# Altium project OSSI-1 Beacon.PrjPcb
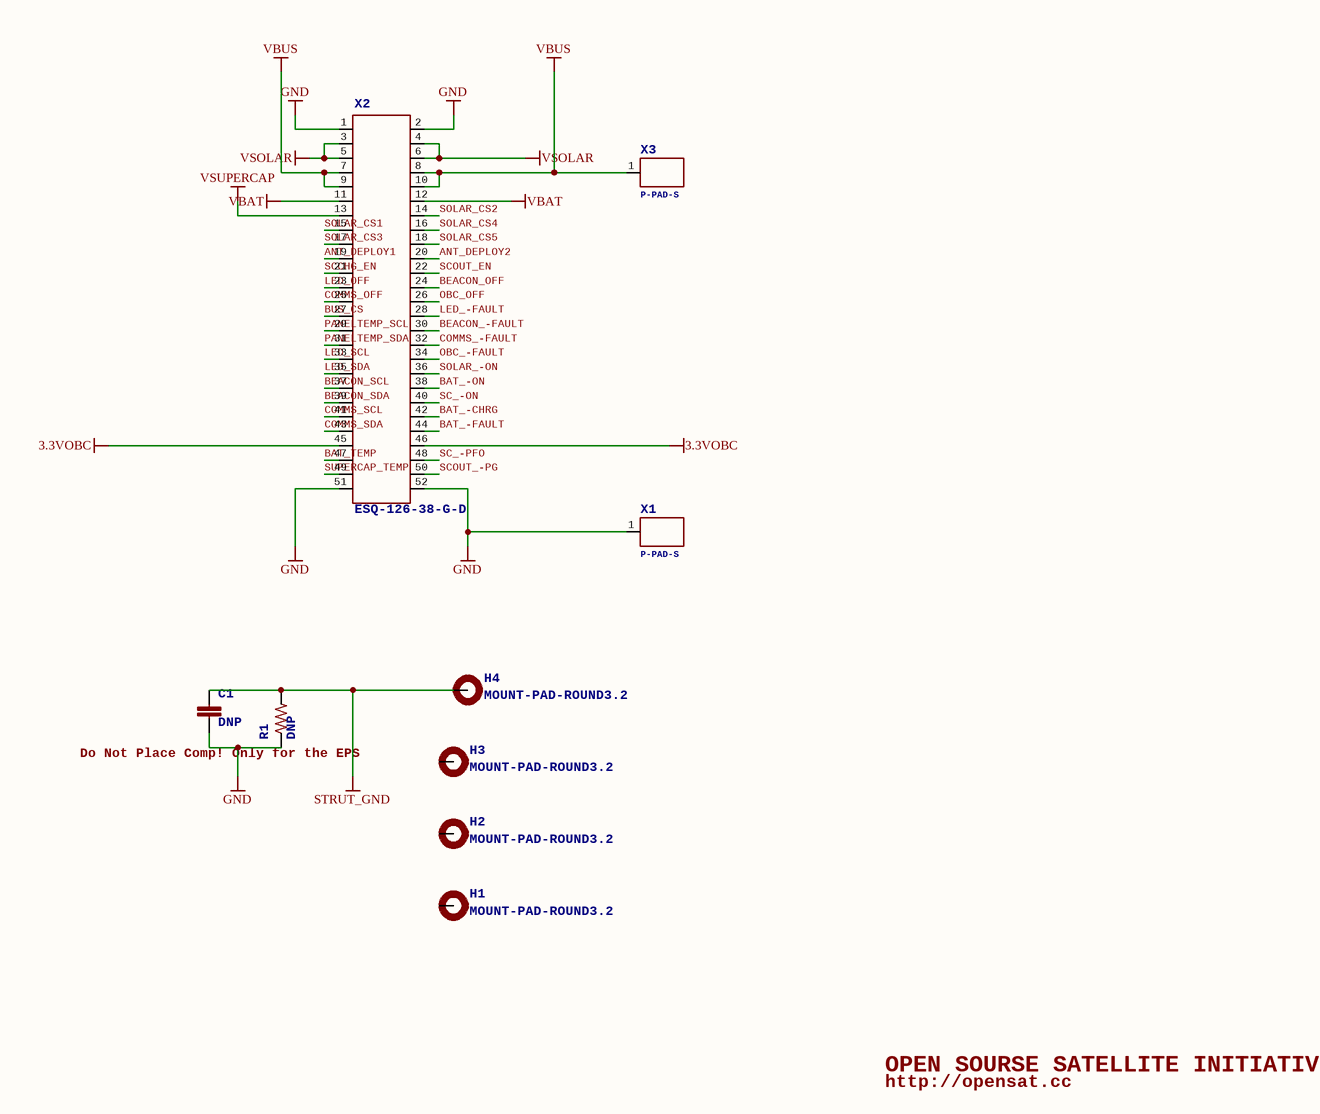
[diagram p0: OSSI-1 Beacon_0.SchDoc]
4 sheets, 116 parts. Net scope: global (net labels, ports and power ports of the same name join across sheets).
Board file: OSSI-1 Beacon.PcbDoc
Sheets:
  OSSI-1 Beacon_0.SchDoc
  OSSI-1 Beacon_1.SchDoc
  OSSI-1 Beacon_2.SchDoc
  OSSI-1 Beacon_3.SchDoc

## Sheet OSSI-1 Beacon_0.SchDoc: TITLE:
size 410 x 286 mm; Date: Date:; >LAST_DATE_TIME: 01/11/2015 13:17:32; Sheet:: Sheet:; >SHEET: 1; REV:: REV:; Document Number:: Document Number:; >DRAWING_NAME: OSSI-1 Beacon.sch

### Parts
C1  >NAME: C1  [C0805(2012)]  (hidden comment: DNP)
H1  >NAME: H1  [3.2-PAD-ROUND]  (hidden comment: MOUNT-PAD-ROUND3.2)
H2  >NAME: H2  [3.2-PAD-ROUND]  (hidden comment: MOUNT-PAD-ROUND3.2)
H3  >NAME: H3  [3.2-PAD-ROUND]  (hidden comment: MOUNT-PAD-ROUND3.2)
H4  >NAME: H4  [3.2-PAD-ROUND]  (hidden comment: MOUNT-PAD-ROUND3.2)
R1  >NAME: R1  [WSL1206]  (hidden comment: DNP)
X1  >NAME: X1  [P-PAD-S]  (hidden comment: P-PAD-S)
X2  >NAME: X2  [ESQ-126-XX-X-D]  (hidden comment: ESQ-126-38-G-D)
X3  >NAME: X3  [P-PAD-S]  (hidden comment: P-PAD-S)

### Nets
3.3VOBC: X2.45 X2.46
GND: C1.2 R1.P$1 X1.1(P$1) X2.1 X2.2 X2.51 X2.52
STRUT_GND: C1.1 H4.B3,2(MOUNT) R1.P$2
VBAT: X2.11 X2.12
VBUS: X2.7 X2.8 X2.9 X2.10 X3.1(P$1)
VSOLAR: X2.3 X2.4 X2.5 X2.6
VSUPERCAP: X2.13
ANT_DEPLOY1: X2.19
ANT_DEPLOY2: X2.20
BAT_-CHRG: X2.42
BAT_-FAULT: X2.44
BAT_-ON: X2.38
BAT_TEMP: X2.47
BEACON_-FAULT: X2.30
BEACON_OFF: X2.24
BEACON_SCL: X2.37
BEACON_SDA: X2.39
BUS_CS: X2.27
COMMS_-FAULT: X2.32
COMMS_OFF: X2.25
COMMS_SCL: X2.41
COMMS_SDA: X2.43
LED_-FAULT: X2.28
LED_OFF: X2.23
LED_SCL: X2.33
LED_SDA: X2.35
OBC_-FAULT: X2.34
OBC_OFF: X2.26
PANELTEMP_SCL: X2.29
PANELTEMP_SDA: X2.31
SC_-ON: X2.40
SC_-PFO: X2.48
SCCHG_EN: X2.21
SCOUT_-PG: X2.50
SCOUT_EN: X2.22
SOLAR_-ON: X2.36
SOLAR_CS1: X2.15
SOLAR_CS2: X2.14
SOLAR_CS3: X2.17
SOLAR_CS4: X2.16
SOLAR_CS5: X2.18
SUPERCAP_TEMP: X2.49

Not connected (* = marked no-connect by the designer): H1 B3,2(MOUNT); H2 B3,2(MOUNT); H3 B3,2(MOUNT)

### Notes on the sheet
- (near R1) Do Not Place Comp! Only for the EPS
- OPEN SOURSE SATELLITE INITIATIVE
- http://opensat.cc

### Library data of the parts
C1 = C0805(2012): >VALUE: DNP
R1 = RWSL1206: >VALUE: DNP
X2 = ESQ-126-38-G-D: <b>Samtec ESQ-126-XX-G-D Elevated Sockets Seires</b> / <ul> / <li> ESQ-126-37-G-D</li> / <li> ESQ-126-38-G-D</li> / <li> ESQ-126-39-G-D</li> / </ul>; >VALUE: ESQ-126-38-G-D
H1-H4 = MOUNT-PAD-ROUND3.2: >VALUE: MOUNT-PAD-ROUND3.2
X1 X3 = P-PAD-S: >VALUE: P-PAD-S

## Sheet OSSI-1 Beacon_1.SchDoc: TITLE:
size 410 x 286 mm; Date: Date:; >LAST_DATE_TIME: 01/11/2015 13:17:35; Sheet:: Sheet:; >SHEET: 2; REV:: REV:; Document Number:: Document Number:; >DRAWING_NAME: OSSI-1 Beacon.sch
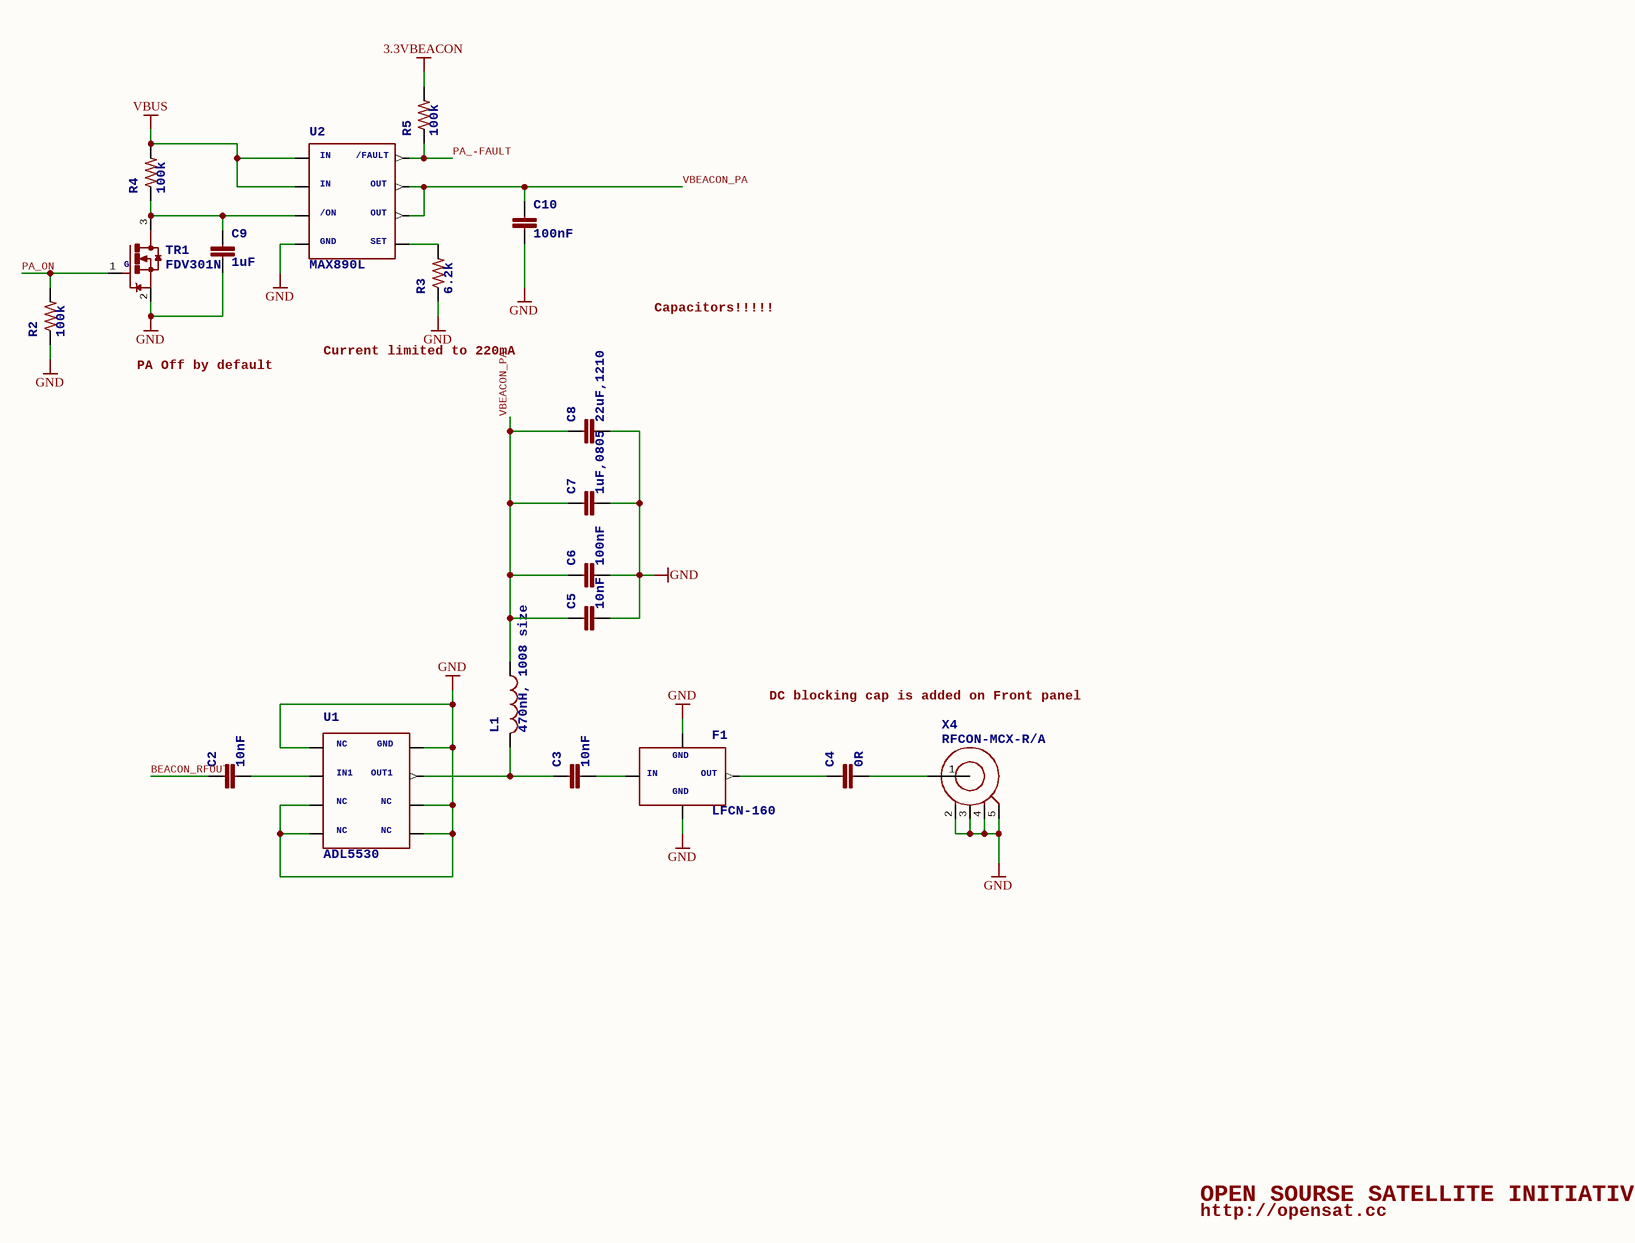
[diagram p1: OSSI-1 Beacon_1.SchDoc]

### Parts
C2  >NAME: C2  [C0603(1608)]  (hidden comment: 10nF)
C3  >NAME: C3  [C0603(1608)]  (hidden comment: 10nF)
C4  >NAME: C4  [C0603(1608)]  (hidden comment: 0R)
C5  >NAME: C5  [C0603(1608)]  (hidden comment: 10nF)
C6  >NAME: C6  [C0603(1608)]  (hidden comment: 100nF)
C7  >NAME: C7  [C0805(2012)]  (hidden comment: 1uF,0805)
C8  >NAME: C8  [C1210-GCM32]  (hidden comment: 22uF,1210)
C9  >NAME: C9  [C0603(1608)]  (hidden comment: 1uF)
C10  >NAME: C10  [C0603(1608)]  (hidden comment: 100nF)
F1  >NAME: F1  [LFCN]  (hidden comment: LFCN-160)
L1  >NAME: L1  [L1008(2520)]  (hidden comment: 470nH, 1008 size)
R2  >NAME: R2  [R0603(1608)]  (hidden comment: 100k)
R3  >NAME: R3  [R0603(1608)]  (hidden comment: 6.2k)
R4  >NAME: R4  [R0603(1608)]  (hidden comment: 100k)
R5  >NAME: R5  [R0603(1608)]  (hidden comment: 100k)
TR1  >NAME: TR1  [SOT23]  (hidden comment: FDV301N)
U1  >NAME: U1  [LFCSP8_CP]  (hidden comment: ADL5530)
U2  >NAME: U2  [SO8]  (hidden comment: MAX890L)
X4  >NAME: X4  [MCX-R/A]  (hidden comment: RFCON-MCX-R/A)

### Nets
3.3VBEACON: R5.2
GND: C5.2 C6.2 C7.2 C8.P$2 C9.2 C10.2 F1.2(P$2) F1.4(P$4) R2.1 R3.1 TR1.2(S) U1.1 U1.3 U1.4 U1.5 U1.6 U1.8 U2.4(P$4) X4.2 X4.3 X4.4 X4.5
VBUS: R4.2 U2.1(P$1) U2.2(P$2)
BEACON_RFOUT: C2.1
PA_-FAULT: R5.1 U2.8(P$8)
PA_ON: R2.2 TR1.1(G)
VBEACON_PA: C5.1 C6.1 C7.1 C8.P$1 C10.1 L1.P$1 U2.6(P$6) U2.7(P$7)
NetC2_2: C2.2 U1.2
NetC3_1: C3.1 L1.P$2 U1.7
NetC3_2: C3.2 F1.1(P$1)
NetC4_1: C4.1 F1.3(P$3)
NetC4_2: C4.2 X4.1
NetC9_1: C9.1 R4.1 TR1.3(D) U2.3(P$3)
NetR3_2: R3.2 U2.5(P$5)

### Notes on the sheet
- PA Off by default
- Current limited to 220mA
- Capacitors!!!!!
- DC blocking cap is added on Front panel
- OPEN SOURSE SATELLITE INITIATIVE
- http://opensat.cc

### Library data of the parts
C2-C6 C9 C10 = C0603(1608)
  C2 C3 C5: >VALUE: 10nF
  C4: >VALUE: 0R
  C6 C10: >VALUE: 100nF
  C9: >VALUE: 1uF
C7 = C0805(2012): >VALUE: 1uF,0805
C8 = C1210(3225)-GCM32: >VALUE: 22uF,1210
F1 = LFCN-160: <b>LFCN-160 Low Pass Filter</b> / <ul> / <li>DC - 160MHz Low Pass Filter</li> / <li>Cut Off Freq: 230MHz</li> / <li>8W power rating ( degraded to 3W at 100 celcius degree)</li> / </ul>; IN: IN; OUT: OUT; GND: GND; >VALUE: LFCN-160
L1 = L1008(2502): >VALUE: 470nH, 1008 size
R2-R5 = R0603(1608)
  R2 R4 R5: >VALUE: 100k
  R3: >VALUE: 6.2k
TR1 = FDV301N: FDV301N Digital N channel - FET / Rdson = 5 Ohm / Vgs = 0.7~1.06V / Ids = 220mA; G: G; >VALUE: FDV301N
U1 = ADL5530: <b>ADL5530</b> / <ul> / <li>IF Gain Block</li> / <li>Fixed gain: 16.dB</li> / <li>Operation: 0~1000Mhz</li> / <li>Internally matched input and output to 50 Ω</li> / <li>Power supply: 3V or 5V</li> / <li>110 mA power supply current</li> / </ul>; >VALUE: ADL5530; NC: NC; IN1: IN1; GND: GND; OUT1: OUT1
U2 = MAX890L: <B>MAX 890L</B> / <BR /> / 1.2A, Current-Limited, High-Side / P-Channel Switch with Thermal Shutdown BY MAXIM; IN: IN; /ON: /ON; GND: GND; SET: SET; OUT: OUT; /FAULT: /FAULT; >VALUE: MAX890L
X4 = RFCON-MCX-R/A: RF Connectors; >VALUE: RFCON-MCX-R/A

## Sheet OSSI-1 Beacon_2.SchDoc: TITLE:
size 410 x 286 mm; Date: Date:; >LAST_DATE_TIME: 01/11/2015 13:17:37; Sheet:: Sheet:; >SHEET: 3; REV:: REV:; Document Number:: Document Number:; >DRAWING_NAME: OSSI-1 Beacon.sch
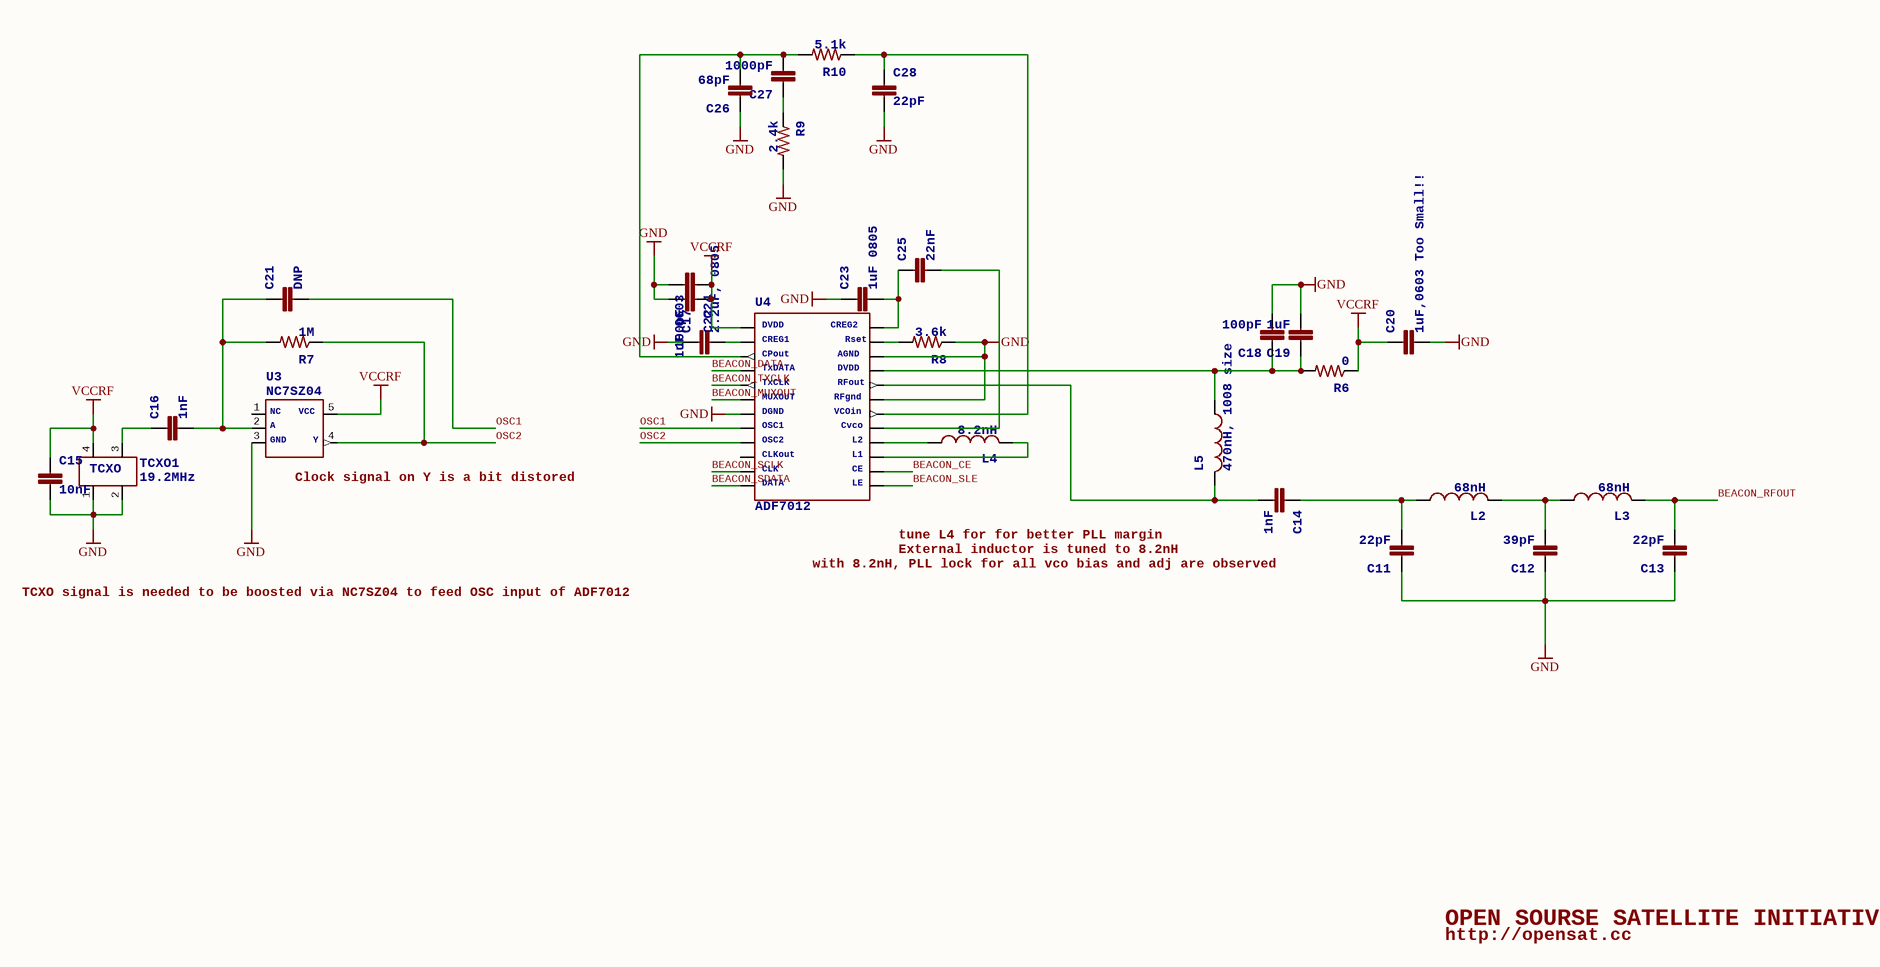
[diagram p2: OSSI-1 Beacon_2.SchDoc]

### Parts
C11  >NAME: C11  [C0603(1608)]  (hidden comment: 22pF)
C12  >NAME: C12  [C0603(1608)]  (hidden comment: 39pF)
C13  >NAME: C13  [C0603(1608)]  (hidden comment: 22pF)
C14  >NAME: C14  [C0603(1608)]  (hidden comment: 1nF)
C15  >NAME: C15  [C0603(1608)]  (hidden comment: 10nF)
C16  >NAME: C16  [C0603(1608)]  (hidden comment: 1nF)
C17  >NAME: C17  [C0805(2012)]  (hidden comment: 2.2uF, 0805)
C18  >NAME: C18  [C0603(1608)]  (hidden comment: 100pF)
C19  >NAME: C19  [C0603(1608)]  (hidden comment: 1uF)
C20  >NAME: C20  [C0603(1608)]  (hidden comment: 1uF,0603 Too Small!!)
C21  >NAME: C21  [C0603(1608)]  (hidden comment: DNP)
C22  >NAME: C22  [C0603(1608)]  (hidden comment: 100pF)
C23  >NAME: C23  [C0805(2012)]  (hidden comment: 1uF 0805)
C24  >NAME: C24  [C0603(1608)]  (hidden comment: 1uF,0603)
C25  >NAME: C25  [C0603(1608)]  (hidden comment: 22nF)
C26  >NAME: C26  [C0603(1608)]  (hidden comment: 68pF)
C27  >NAME: C27  [C0603(1608)]  (hidden comment: 1000pF)
C28  >NAME: C28  [C0603(1608)]  (hidden comment: 22pF)
L2  >NAME: L2  [L0603(1608)]  (hidden comment: 68nH)
L3  >NAME: L3  [L0603(1608)]  (hidden comment: 68nH)
L4  >NAME: L4  [L0603(1608)]  (hidden comment: 8.2nH)
L5  >NAME: L5  [L1008(2520)]  (hidden comment: 470nH, 1008 size)
R6  >NAME: R6  [R0603(1608)]  (hidden comment: 0)
R7  >NAME: R7  [R0603(1608)]  (hidden comment: 1M)
R8  >NAME: R8  [R0603(1608)]  (hidden comment: 3.6k)
R9  >NAME: R9  [R0603(1608)]  (hidden comment: 2.4k)
R10  >NAME: R10  [R0603(1608)]  (hidden comment: 5.1k)
TCXO1  >NAME: TCXO1  [TCXO_M532]  (hidden comment: 19.2MHz)
U3  >NAME: U3  [SC70-5]  (hidden comment: NC7SZ04)
U4  >NAME: U4  [TSSOP24]  (hidden comment: ADF7012)

### Nets
GND: C11.1 C12.1 C13.1 C15.2 C17.1 C18.2 C19.2 C20.2 C22.2 C23.1 C24.2 C26.1 C28.2 R8.1 R9.2 TCXO1.1(P$1) TCXO1.2(P$2) U3.3(P$3) U4.7(DGND) U4.19(RFGND) U4.22(AGND)
VCCRF: C15.1 C20.1 C22.1 C24.1 R6.1 TCXO1.4(P$4) U3.5(P$5) U4.1(DVDD_1)
BEACON_CE: U4.14(CE)
BEACON_DATA: U4.4(TXDATA)
BEACON_MUXOUT: U4.6(MUXOUT)
BEACON_RFOUT: C13.2 L3.2
BEACON_SCLK: U4.11(CLK)
BEACON_SDATA: U4.12(DATA)
BEACON_SLE: U4.13(LE)
BEACON_TXCLK: U4.5(TXCLK)
OSC1: C21.2 U4.8(OSC1)
OSC2: R7.1 U3.4(P$4) U4.9(OSC2)
NetC11_2: C11.2 C14.1 L2.1
NetC12_2: C12.2 L2.2 L3.1
NetC14_2: C14.2 L5.P$2 U4.20(RFOUT)
NetC16_1: C16.1 TCXO1.3(P$3)
NetC16_2: C16.2 C21.1 R7.2 U3.2(P$2)
NetC17_2: C17.2 U4.2(CREG1)
NetC18_1: C18.1 C19.1 L5.P$1 R6.2 U4.21(DVDD_2)
NetC23_2: C23.2 C25.1 U4.24(CREG2)
NetC25_2: C25.2 U4.17(CVCO)
NetC26_2: C26.2 C27.2 R10.2 U4.3(CPOUT)
NetC27_1: C27.1 R9.1
NetC28_1: C28.1 R10.1 U4.18(VCOIN)
NetL4_1: L4.1 U4.16(L2)
NetL4_2: L4.2 U4.15(L1)
NetR8_2: R8.2 U4.23(RSET)

Not connected (* = marked no-connect by the designer): U3 1(P$1); U4 10(CLKOUT)

### Notes on the sheet
- (near U3) Clock signal on Y is a bit distored
- TCXO signal is needed to be boosted via NC7SZ04 to feed OSC input of ADF7012
- with 8.2nH, PLL lock for all vco bias and adj are observed
- (near U4) tune L4 for for better PLL margin
- External inductor is tuned to 8.2nH
- OPEN SOURSE SATELLITE INITIATIVE
- http://opensat.cc

### Library data of the parts
C11-C16 C18-C22 C24-C28 = C0603(1608)
  C11 C13 C28: >VALUE: 22pF
  C12: >VALUE: 39pF
  C14 C16: >VALUE: 1nF
  C15: >VALUE: 10nF
  C18 C22: >VALUE: 100pF
  C19: >VALUE: 1uF
  C20: >VALUE: 1uF,0603 Too Small!!
  C21: >VALUE: DNP
  C24: >VALUE: 1uF,0603
  C25: >VALUE: 22nF
  C26: >VALUE: 68pF
  C27: >VALUE: 1000pF
C17 C23 = C0805(2012)
  C17: >VALUE: 2.2uF, 0805
  C23: >VALUE: 1uF 0805
L2-L4 = L0603(1608)
  L2 L3: >VALUE: 68nH
  L4: >VALUE: 8.2nH
L5 = L1008(2502): >VALUE: 470nH, 1008 size
R6-R10 = R0603(1608)
  R6: >VALUE: 0
  R7: >VALUE: 1M
  R8: >VALUE: 3.6k
  R9: >VALUE: 2.4k
  R10: >VALUE: 5.1k
TCXO1 = TCXO-M532: <b>532L25DT19M2000: CTO electronic components Model 532 19.2MHz TCXO for RF transeiver</b> / <ul> / <li>Clipped Sine Wave Output</li> / <li>Operating Voltage, +3.3Vdc</li> / <li>Operating Temperature to -30°C to +85°C</li> / <li>Frequency Stability: ±2.5ppm</li> / </ul>; TCXO: TCXO; >VALUE: 19.2MHz
U3 = NC7SZ04: UHS Inverter NC7SZ04; >VALUE: NC7SZ04; NC: NC; A: A; GND: GND; VCC: VCC; Y: Y
U4 = ADF7012: >VALUE: ADF7012; DVDD: DVDD; CREG1: CREG1; CPout: CPout; TxDATA: TxDATA; MUXOUT: MUXOUT; DGND: DGND; OSC1: OSC1; OSC2: OSC2; CLKout: CLKout; CLK: CLK; DATA: DATA; TxCLK: TxCLK; LE: LE; CE: CE; L1: L1; L2: L2; Cvco: Cvco; VCOin: VCOin; RFgnd: RFgnd; RFout: RFout; AGND: AGND; Rset: Rset; CREG2: CREG2

## Sheet OSSI-1 Beacon_3.SchDoc: TITLE:
size 410 x 286 mm; Date: Date:; >LAST_DATE_TIME: 01/11/2015 13:17:40; Sheet:: Sheet:; >SHEET: 4; REV:: REV:; Document Number:: Document Number:; >DRAWING_NAME: OSSI-1 Beacon.sch
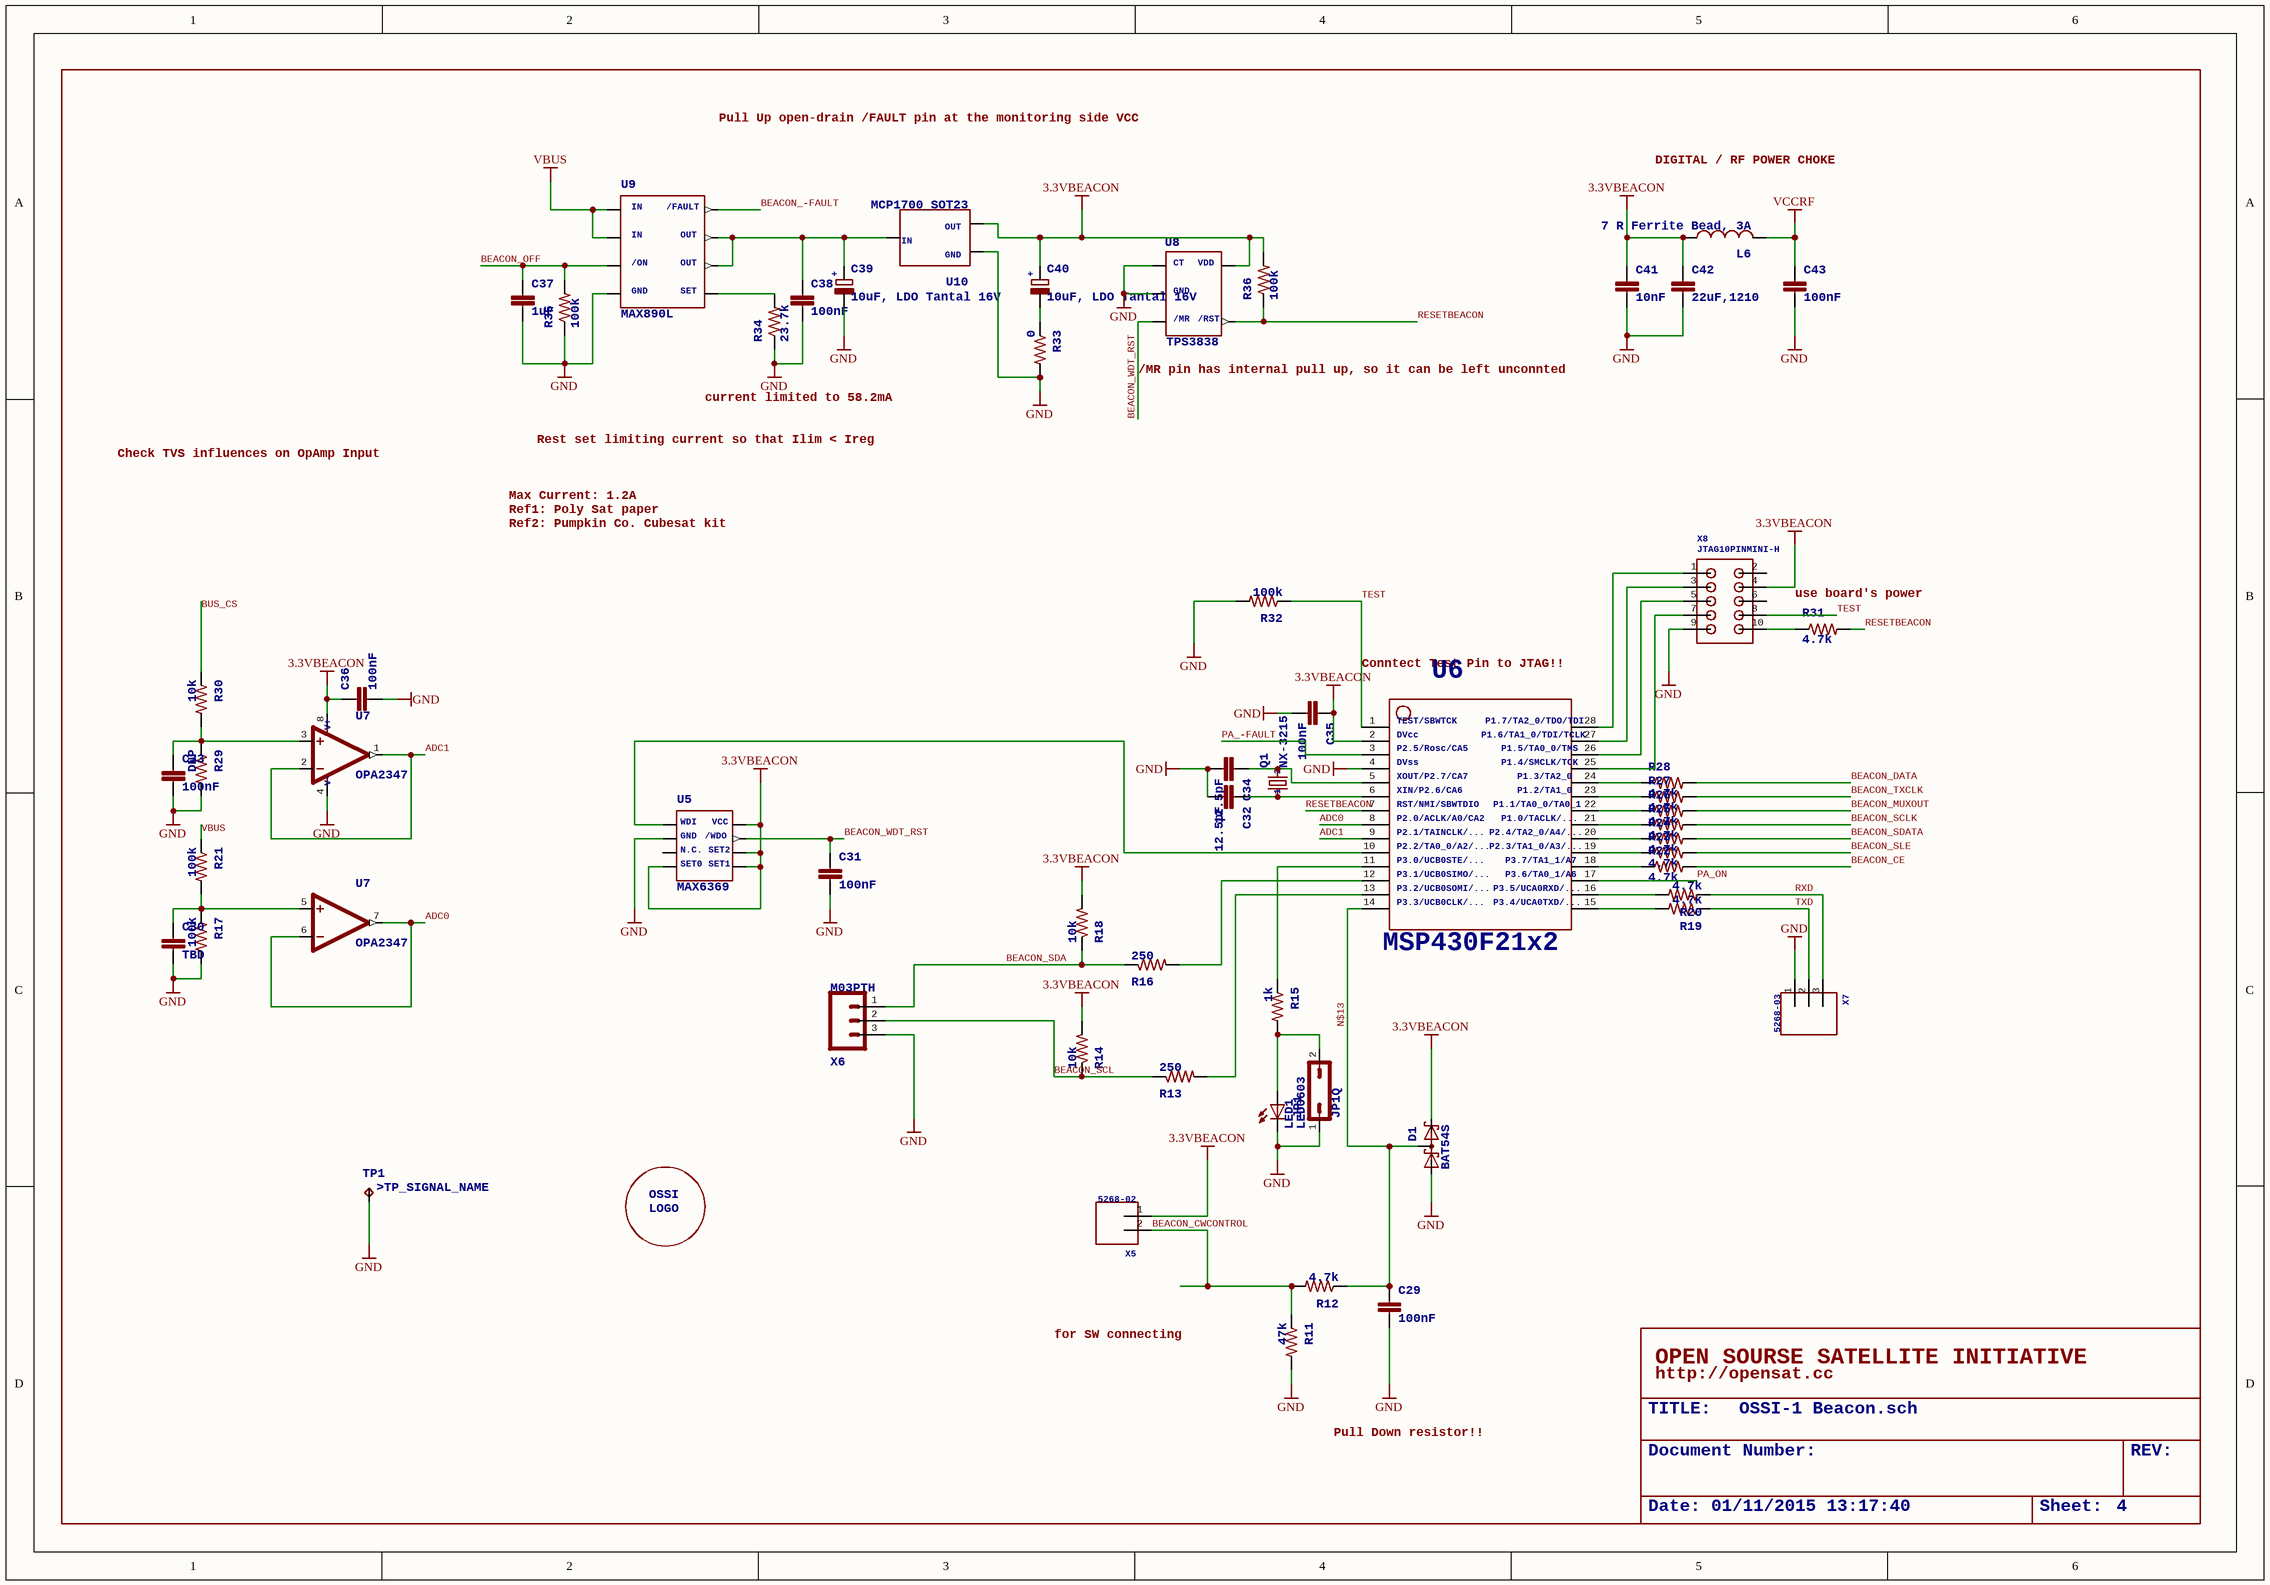
[diagram p3: OSSI-1 Beacon_3.SchDoc]

### Parts
C29  >NAME: C29  [C0603(1608)]  (hidden comment: 100nF)
C30  >NAME: C30  [C0603(1608)]  (hidden comment: TBD)
C31  >NAME: C31  [C0603(1608)]  (hidden comment: 100nF)
C32  >NAME: C32  [C0603(1608)]  (hidden comment: 12.5pF)
C33  >NAME: C33  [C0603(1608)]  (hidden comment: 100nF)
C34  >NAME: C34  [C0603(1608)]  (hidden comment: 12.5pF)
C35  >NAME: C35  [C0603(1608)]  (hidden comment: 100nF)
C36  >NAME: C36  [C0603(1608)]  (hidden comment: 100nF)
C37  >NAME: C37  [C0603(1608)]  (hidden comment: 1uF)
C38  >NAME: C38  [C0603(1608)]  (hidden comment: 100nF)
C39  >NAME: C39  [C1206(3216)-A]  (hidden comment: 10uF, LDO Tantal 16V)
C40  >NAME: C40  [C1206(3216)-A]  (hidden comment: 10uF, LDO Tantal 16V)
C41  >NAME: C41  [C0603(1608)]  (hidden comment: 10nF)
C42  >NAME: C42  [C1210-GCM32]  (hidden comment: 22uF,1210)
C43  >NAME: C43  [C0603(1608)]  (hidden comment: 100nF)
D1  >NAME: D1  [SOT23]  (hidden comment: BAT54S)
JP1  JP1Q  [JP1]
L6  >NAME: L6  [L0805(2012)]  (hidden comment: 7 R Ferrite Bead, 3A)
LED1  >NAME: LED1  [LED-0603]  (hidden comment: LED0603)
Q1  >NAME: Q1  [NX-3215]  (hidden comment: NX-3215)
R11  >NAME: R11  [R0603(1608)]  (hidden comment: 47k)
R12  >NAME: R12  [R0603(1608)]  (hidden comment: 4.7k)
R13  >NAME: R13  [R0603(1608)]  (hidden comment: 250)
R14  >NAME: R14  [R0603(1608)]  (hidden comment: 10k)
R15  >NAME: R15  [R0603(1608)]  (hidden comment: 1k)
R16  >NAME: R16  [R0603(1608)]  (hidden comment: 250)
R17  >NAME: R17  [R0603(1608)]  (hidden comment: 100k)
R18  >NAME: R18  [R0603(1608)]  (hidden comment: 10k)
R19  >NAME: R19  [R0603(1608)]  (hidden comment: 4.7k)
R20  >NAME: R20  [R0603(1608)]  (hidden comment: 4.7k)
R21  >NAME: R21  [R0603(1608)]  (hidden comment: 100k)
R22  >NAME: R22  [R0603(1608)]  (hidden comment: 4.7k)
R23  >NAME: R23  [R0603(1608)]  (hidden comment: 4.7k)
R24  >NAME: R24  [R0603(1608)]  (hidden comment: 4.7k)
R25  >NAME: R25  [R0603(1608)]  (hidden comment: 4.7k)
R26  >NAME: R26  [R0603(1608)]  (hidden comment: 4.7k)
R27  >NAME: R27  [R0603(1608)]  (hidden comment: 4.7k)
R28  >NAME: R28  [R0603(1608)]  (hidden comment: 4.7k)
R29  >NAME: R29  [R0603(1608)]  (hidden comment: DNP)
R30  >NAME: R30  [R0603(1608)]  (hidden comment: 10k)
R31  >NAME: R31  [R0603(1608)]  (hidden comment: 4.7k)
R32  >NAME: R32  [R0603(1608)]  (hidden comment: 100k)
R33  >NAME: R33  [R0603(1608)]  (hidden comment: 0)
R34  >NAME: R34  [R0603(1608)]  (hidden comment: 23.7k)
R35  >NAME: R35  [R0603(1608)]  (hidden comment: 100k)
R36  >NAME: R36  [R0603(1608)]  (hidden comment: 100k)
TP1  >NAME: TP1  [TP-13]  (hidden comment: TP)
U5  >NAME: U5  [SOT23-8]  (hidden comment: MAX6369)
U6  >NAME: U6  [PW28]  (hidden comment: MSP430F2132)
U7  >NAME: U7  [SOT23-8DCN]  (hidden comment: OPA2347)  (parts A,B of 2)
U8  >NAME: U8  [SOT23-5DBV]  (hidden comment: TPS3838)
U9  >NAME: U9  [SO8]  (hidden comment: MAX890L)
U10  >NAME: U10  [SOT23]  (hidden comment: MCP1700_SOT23)
U$1  OSSILOGORECT  [OSSILOGORECT1005]  (value not drawn)
X5  >NAME: X5  [5628-02]  (hidden comment: 5268-02)
X6  >NAME: X6  [1X03]  (hidden comment: M03PTH)
X7  >NAME: X7  [5268-03]  (hidden comment: 5268-03)
X8  >NAME: X8  [M50-3200545]  (hidden comment: JTAG10PINMINI-H)

### Nets
3.3VBEACON: C35.1 C36.1 C40.1(+) C41.1 C42.P$1 D1.2(C2) L6.1 R14.2 R18.2 R36.2 U5.4(P$4) U5.5(P$5) U5.6(P$6) U5.8(P$8) U6.2 U7.8(V+) U8.5(P$5) U10.2 X5.1 X8.4
GND: C29.2 C30.2 C31.2 C32.2 C33.2 C34.2 C35.2 C36.2 C37.2 C38.2 C39.2(-) C41.2 C42.P$2 C43.2 D1.1(A1) JP1.1 LED1.C R11.2 R17.2 R29.2 R32.2 R33.2 R34.1 R35.1 TP1.TP U5.2(P$2) U6.4 U7.4(V-) U8.1(P$1) U8.2(P$2) U9.4(P$4) U10.1 X6.3 X7.1 X8.9
VBUS: R21.1 U9.1(P$1) U9.2(P$2)
VCCRF: C43.1 L6.2
ADC0: U6.8 U7.6(-IN) U7.7(OUT)
ADC1: U6.9 U7.1(OUT) U7.2(-IN)
BEACON_-FAULT: U9.8(P$8)
BEACON_CE: R22.2
BEACON_CWCONTROL: R11.1 R12.2 X5.2
BEACON_DATA: R28.2
BEACON_MUXOUT: R26.2
BEACON_OFF: C37.1 R35.2 U9.3(P$3)
BEACON_SCL: R13.1 R14.1 X6.2
BEACON_SCLK: R25.2
BEACON_SDA: R16.1 R18.1 X6.1
BEACON_SDATA: R24.2
BEACON_SLE: R23.2
BEACON_TXCLK: R27.2
BEACON_WDT_RST: C31.1 U5.7(P$7) U8.3(P$3)
BUS_CS: R30.1
N$13: C29.1 D1.3(C1A2) R12.1 U6.14
PA_-FAULT: U6.3
PA_ON: U6.17
RESETBEACON: R31.2 R36.1 U6.7 U8.4(P$4)
RXD: R20.1 X7.3
TEST: R32.1 U6.1 X8.8
TXD: R19.1 X7.2
NetC30_1: C30.1 R17.1 R21.2 U7.5(+IN)
NetC32_1: C32.1 Q1.1 U6.6
NetC33_1: C33.1 R29.1 R30.2 U7.3(+IN)
NetC34_1: C34.1 Q1.2 U6.5
NetC38_1: C38.1 C39.1(+) U9.6(P$6) U9.7(P$7) U10.3
NetC40_2: C40.2(-) R33.1
NetJP1_2: JP1.2 LED1.A R15.2
NetR13_2: R13.2 U6.13
NetR15_1: R15.1 U6.11
NetR16_2: R16.2 U6.12
NetR19_2: R19.2 U6.15
NetR20_2: R20.2 U6.16
NetR22_1: R22.1 U6.18
NetR23_1: R23.1 U6.19
NetR24_1: R24.1 U6.20
NetR25_1: R25.1 U6.21
NetR26_1: R26.1 U6.22
NetR27_1: R27.1 U6.23
NetR28_1: R28.1 U6.24
NetR31_1: R31.1 X8.10
NetR34_2: R34.2 U9.5(P$5)
NetU5_1: U5.1(P$1) U6.10
NetU6_25: U6.25 X8.7
NetU6_26: U6.26 X8.5
NetU6_27: U6.27 X8.3
NetU6_28: U6.28 X8.1

Not connected (* = marked no-connect by the designer): U5 3(P$3); X8 2 6

### Notes on the sheet
- Pull Up open-drain /FAULT pin at the monitoring side VCC
- DIGITAL / RF POWER CHOKE
- current limited to 58.2mA
- (near U8) /MR pin has internal pull up, so it can be left unconnted
- Check TVS influences on OpAmp Input
- Rest set limiting current so that Ilim < Ireg
- Max Current: 1.2A
- Ref1: Poly Sat paper
- Ref2: Pumpkin Co. Cubesat kit
- (near R31) use board's power
- Conntect Test Pin to JTAG!!
- for SW connecting
- OPEN SOURSE SATELLITE INITIATIVE
- http://opensat.cc
- Pull Down resistor!!

### Library data of the parts
C29-C38 C41 C43 = C0603(1608)
  C29 C31 C33 C35 C36 C38 C43: >VALUE: 100nF
  C30: >VALUE: TBD
  C32 C34: >VALUE: 12.5pF
  C37: >VALUE: 1uF
  C41: >VALUE: 10nF
C39 C40 = C-TANTAL-A: <b>TAJA105M020RNJ</b> / <ul> / <li>Tantal Capacitor / </li> / <li>Manufacturer: AVX / </li> / <li>1206(3126) / </li> / <li>Ref: www.avx.com/docs/techinfo/tantappl.pdf</li> / </ul>; +: +; >VALUE: 10uF, LDO Tantal 16V
C42 = C1210(3225)-GCM32: >VALUE: 22uF,1210
D1 = BAT54S: <b>Schottky Diodes</b><p> / Pin connection corrected 2011-05-04<br> / Source: Fairchild .. BAT54.pdf; >VALUE: BAT54S
JP1 = JP1Q: <b>JUMPER</b>; >NAME: JP1; >VALUE: JP1Q
L6 = L0805(2012): >VALUE: 7 R Ferrite Bead, 3A
LED1 = LED0603: <b>LEDs</b> / Standard schematic elements and footprints for 5mm, 3mm, 1206, and 0603 sized LEDs. 5mm - Spark Fun Electronics SKU : COM-00529 (and others); >VALUE: LED0603
Q1 = NX-3215: NDK 32.768 kHz SMD Crystal<br /> / P/N: NX3215SA-32.768K-STD-MUA-9<br /> / <br /> / <b>Nominal frequency (kHz):</b> 32.768 <br/> / <b>Package Size (L×W×H : mm):</b>  3.2×1.5×0.8 <br/> / <b>Operating Temperature Range(*1)  /  Storage Temperature Range   (°C):</b>  -40 to +85  /  -40 to +85<br/> / <b>Level of drive:</b>   0.1µW (Max. 0.5µW) <br/> / <b>Frequency Tolerance (25±3°C):</b>  ±20×10-6 <br/> / <b>Load Capacitance:</b>  9.0pF, 12.5pF <br/> / <b>Equivalent Series Resistance:</b>  70kΩ Max.<br/> / <b>Ordering Code:</b>  NX3215SA-32.768K-STD-MUA-9 (Load Capacitance9.0pF) /NX3215SA-32.768K-STD-MUA-8 (Load Capacitance12.5pF); >VALUE: NX-3215; 1: 1; 2: 2
R11-R36 = R0603(1608)
  R11: >VALUE: 47k
  R12 R19 R20 R22-R28 R31: >VALUE: 4.7k
  R13 R16: >VALUE: 250
  R14 R18 R30: >VALUE: 10k
  R15: >VALUE: 1k
  R17 R21 R32 R35 R36: >VALUE: 100k
  R29: >VALUE: DNP
  R33: >VALUE: 0
  R34: >VALUE: 23.7k
U5 = MAX6369: <B>MAX6369</B> / <ul> / <li>Pin-Selectable Watchdog Timers</li> / <li>Max 6369 is Open-drain output</li> / <li>1 ms to 60 s seletable timeout</li> / </ul>; WDI: WDI; GND: GND; N.C.: N.C.; SET0: SET0; SET1: SET1; SET2: SET2; /WDO: /WDO; VCC: VCC; >VALUE: MAX6369
U6 = MSP430F2132: *** MSP430F21x2 *** PW28; TEST/SBWTCK: TEST/SBWTCK; DVcc: DVcc; P2.5/Rosc/CA5: P2.5/Rosc/CA5; DVss: DVss; XOUT/P2.7/CA7: XOUT/P2.7/CA7; XIN/P2.6/CA6: XIN/P2.6/CA6; RST/NMI/SBWTDIO: RST/NMI/SBWTDIO; P2.0/ACLK/A0/CA2: P2.0/ACLK/A0/CA2; P2.1/TAINCLK/...: P2.1/TAINCLK/...; P2.2/TA0_0/A2/...: P2.2/TA0_0/A2/...; P1.7/TA2_0/TDO/TDI: P1.7/TA2_0/TDO/TDI; P1.6/TA1_0/TDI/TCLK: P1.6/TA1_0/TDI/TCLK; P1.5/TA0_0/TMS: P1.5/TA0_0/TMS; P1.4/SMCLK/TCK: P1.4/SMCLK/TCK; P1.3/TA2_0: P1.3/TA2_0; P1.2/TA1_0: P1.2/TA1_0; P1.1/TA0_0/TA0_1: P1.1/TA0_0/TA0_1; P1.0/TACLK/...: P1.0/TACLK/...; P2.4/TA2_0/A4/...: P2.4/TA2_0/A4/...; P2.3/TA1_0/A3/...: P2.3/TA1_0/A3/...; MSP430F21x2: MSP430F21x2; P3.7/TA1_1/A7: P3.7/TA1_1/A7; P3.6/TA0_1/A6: P3.6/TA0_1/A6; P3.5/UCA0RXD/...: P3.5/UCA0RXD/...; P3.4/UCA0TXD/...: P3.4/UCA0TXD/...; P3.3/UCB0CLK/...: P3.3/UCB0CLK/...; P3.2/UCB0SOMI/...: P3.2/UCB0SOMI/...; P3.1/UCB0SIMO/...: P3.1/UCB0SIMO/...; P3.0/UCB0STE/...: P3.0/UCB0STE/...
U7 = OPA2347: <b>OPA2347</b> / <ul> / <li>RAIL-TO-RAIL INPUT AND OUTPUT</li> / <li>SINGLE SUPPLY: 2.3V to 5.5V</li> / <li>LOW IQ: 20µ</li> / </ul>; >VALUE: OPA2347; V+: V+; V-: V-
U8 = TPS3838: <b>TPS3838</b> / <br /> / NanoPower Supervisory IC from texas instruments.<br /> / TPS3838 is open-drain output; >VALUE: TPS3838; CT: CT; /MR: /MR; GND: GND; VDD: VDD; /RST: /RST
U9 = MAX890L: as U2 on sheet OSSI-1 Beacon_1; IN: IN; /ON: /ON; GND: GND; SET: SET; OUT: OUT; /FAULT: /FAULT; >VALUE: MAX890L
U10 = MCP1700_SOT23: MCP1700 LDO from Microchips; >VALUE: MCP1700_SOT23; IN: IN; GND: GND; OUT: OUT
X6 = M03PTH: <b>Header 3</b> / Standard 3-pin 0.1" header. Use with straight break away headers (SKU : PRT-00116), right angle break away headers (PRT-00553), swiss pins (PRT-00743), machine pins (PRT-00117), and female headers (PRT-00115). Molex polarized connector foot print use with SKU : PRT-08232 with associated crimp pins and housings.; >VALUE: M03PTH
TP1 = TP: >TP_SIGNAL_NAME: >TP_SIGNAL_NAME
U$1 = OSSILOGORECT: OSSI: OSSI; LOGO: LOGO
X5 = 5268-02: >VALUE: 5268-02
X7 = 5268-03: >VALUE: 5268-03
X8 = JTAG10PINMINI-H: >VALUE: JTAG10PINMINI-H

## Nets that join several sheets
3.3VBEACON: OSSI-1 Beacon_1 (R5.2), OSSI-1 Beacon_3 (20 pins)
GND: OSSI-1 Beacon_0 (7 pins), OSSI-1 Beacon_1 (22 pins), OSSI-1 Beacon_2 (21 pins), OSSI-1 Beacon_3 (35 pins)
VBUS: OSSI-1 Beacon_0 (5 pins), OSSI-1 Beacon_1 (R4.2 U2.1 U2.2), OSSI-1 Beacon_3 (R21.1 U9.1 U9.2)
VCCRF: OSSI-1 Beacon_2 (8 pins), OSSI-1 Beacon_3 (C43.1 L6.2)
BEACON_-FAULT: OSSI-1 Beacon_0 (X2.30), OSSI-1 Beacon_3 (U9.8)
BEACON_CE: OSSI-1 Beacon_2 (U4.14), OSSI-1 Beacon_3 (R22.2)
BEACON_DATA: OSSI-1 Beacon_2 (U4.4), OSSI-1 Beacon_3 (R28.2)
BEACON_MUXOUT: OSSI-1 Beacon_2 (U4.6), OSSI-1 Beacon_3 (R26.2)
BEACON_OFF: OSSI-1 Beacon_0 (X2.24), OSSI-1 Beacon_3 (C37.1 R35.2 U9.3)
BEACON_RFOUT: OSSI-1 Beacon_1 (C2.1), OSSI-1 Beacon_2 (C13.2 L3.2)
BEACON_SCL: OSSI-1 Beacon_0 (X2.37), OSSI-1 Beacon_3 (R13.1 R14.1 X6.2)
BEACON_SCLK: OSSI-1 Beacon_2 (U4.11), OSSI-1 Beacon_3 (R25.2)
BEACON_SDA: OSSI-1 Beacon_0 (X2.39), OSSI-1 Beacon_3 (R16.1 R18.1 X6.1)
BEACON_SDATA: OSSI-1 Beacon_2 (U4.12), OSSI-1 Beacon_3 (R24.2)
BEACON_SLE: OSSI-1 Beacon_2 (U4.13), OSSI-1 Beacon_3 (R23.2)
BEACON_TXCLK: OSSI-1 Beacon_2 (U4.5), OSSI-1 Beacon_3 (R27.2)
BUS_CS: OSSI-1 Beacon_0 (X2.27), OSSI-1 Beacon_3 (R30.1)
PA_-FAULT: OSSI-1 Beacon_1 (R5.1 U2.8), OSSI-1 Beacon_3 (U6.3)
PA_ON: OSSI-1 Beacon_1 (R2.2 TR1.1), OSSI-1 Beacon_3 (U6.17)